# Altium schematic sheet [2] MCU.SchDoc
size A4; DocumentNumber: 3; SheetNumber: 3; SheetTotal: 4
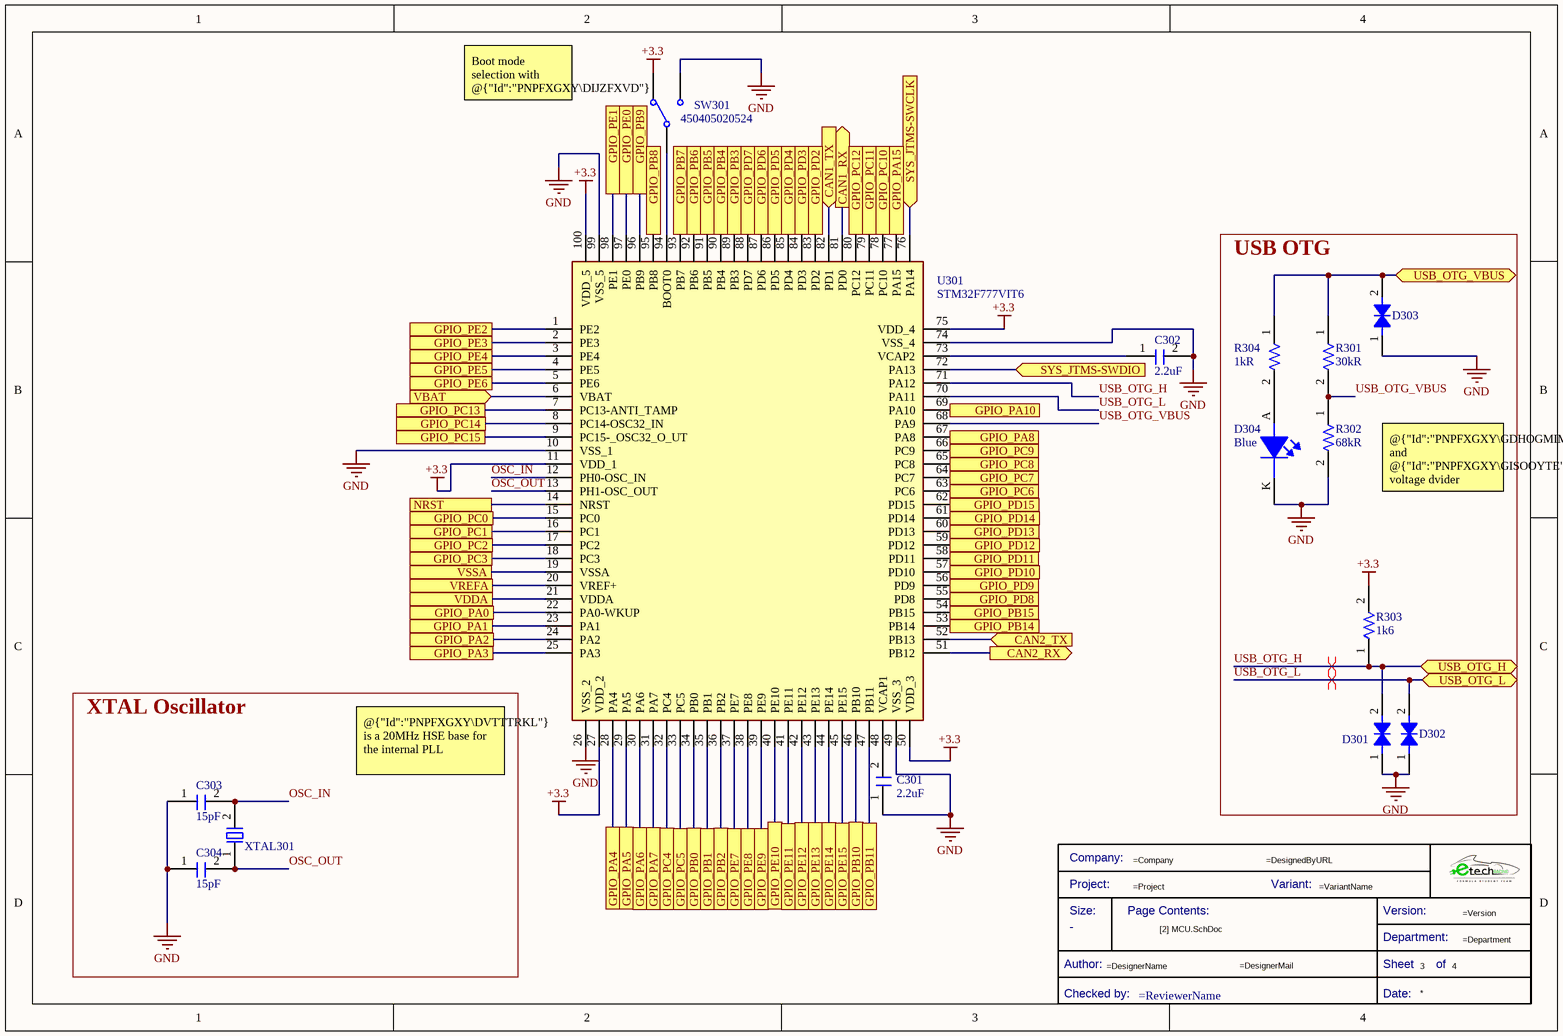
[diagram p0: [2] MCU.SchDoc]

## Parts
*?  Title Block_template  (value not drawn)  (graphical)
C301  Capacitance: 2.2uF  [C2.2u-100V-1812MLCC-X7R]  (hidden comment: HMK432B7225KM-T)
C302  Capacitance: 2.2uF  [C2.2u-100V-1812MLCC-X7R]  (hidden comment: HMK432B7225KM-T)
C303  Capacitance: 15pF  [C0805FNPC-R]  (hidden comment: 885012007052)
C304  Capacitance: 15pF  [C0805FNPC-R]  (hidden comment: 885012007052)
D301  824551301  [DTVS-DO-214AB]  (value not drawn)
D302  824551301  [DTVS-DO-214AB]  (value not drawn)
D303  824551301  [DTVS-DO-214AB]  (value not drawn)
D304  Color: Blue  [LED_0805_WE]  (hidden comment: 150080BS75000)
R301  Resistance: 30kR  [R1206FTK-W]  (hidden comment: CRCW120630K0FKEA)
R302  Resistance: 68kR  [R1206FTK-W]  (hidden comment: CR1206AFX-6802EAS)
R303  Resistance: 1k6  [R1206FTK-W]  (hidden comment: CRCW12061K60FKEA)
R304  Resistance: 1kR  [R0805FTK]  (hidden comment: CR0805-JW-102ELF)
SW301  450405020524  [450405020524]
U301  STM32F777VIT6  [QFP50P1600X1600X160-100N]
XTAL301  830028710  [XTAL20M_SMD]  (value not drawn)

## Blocks framed on the sheet
USB OTG: D301-D304 R301-R304
XTAL Oscillator: C303 C304 XTAL301

## Ports
CAN1_RX (out), CAN1_TX (in), CAN2_RX (out), CAN2_TX (in), GPIO_PA0, GPIO_PA1, GPIO_PA2, GPIO_PA3, GPIO_PA4, GPIO_PA5, GPIO_PA6, GPIO_PA7, GPIO_PA8, GPIO_PA10, GPIO_PA15, GPIO_PB0, GPIO_PB1, GPIO_PB2, GPIO_PB3, GPIO_PB4, GPIO_PB5, GPIO_PB6, GPIO_PB7, GPIO_PB8, GPIO_PB9, GPIO_PB10, GPIO_PB11, GPIO_PB14, GPIO_PB15, GPIO_PC0, GPIO_PC1, GPIO_PC2, GPIO_PC3, GPIO_PC4, GPIO_PC5, GPIO_PC6, GPIO_PC7, GPIO_PC8, GPIO_PC9, GPIO_PC10, GPIO_PC11, GPIO_PC12, GPIO_PC13, GPIO_PC14, GPIO_PC15, GPIO_PD2, GPIO_PD3, GPIO_PD4, GPIO_PD5, GPIO_PD6, GPIO_PD7, GPIO_PD8, GPIO_PD9, GPIO_PD10, GPIO_PD11, GPIO_PD12, GPIO_PD13, GPIO_PD14, GPIO_PD15, GPIO_PE0, GPIO_PE1, GPIO_PE2, GPIO_PE3, GPIO_PE4, GPIO_PE5, GPIO_PE6, GPIO_PE7, GPIO_PE8, GPIO_PE9, GPIO_PE10, GPIO_PE11, GPIO_PE12, GPIO_PE13, GPIO_PE14, GPIO_PE15, NRST, SYS_JTMS-SWCLK (in), SYS_JTMS-SWDIO (in), USB_OTG_H (bidir), USB_OTG_L (bidir), USB_OTG_VBUS (bidir), VBAT (in), VDDA, VREFA, VSSA

## Nets
+3.3: R303.2 SW301.L1 U301.11(VDD_1) U301.27(VDD_2) U301.50(VDD_3) U301.75(VDD_4) U301.100(VDD_5)
GND: C301.1 C302.2 C303.1 C304.1 D301.1 D302.1 D303.1 D304.K R302.2 SW301.L2 U301.10(VSS_1) U301.26(VSS_2) U301.49(VSS_3) U301.74(VSS_4) U301.99(VSS_5)
CAN1_RX: U301.81(PD0) ; port CAN1_RX
CAN1_TX: U301.82(PD1) ; port CAN1_TX
CAN2_RX: U301.51(PB12) ; port CAN2_RX
CAN2_TX: U301.52(PB13) ; port CAN2_TX
GPIO_PA0: U301.22(PA0-WKUP) ; port GPIO_PA0
GPIO_PA1: U301.23(PA1) ; port GPIO_PA1
GPIO_PA2: U301.24(PA2) ; port GPIO_PA2
GPIO_PA3: U301.25(PA3) ; port GPIO_PA3
GPIO_PA4: U301.28(PA4) ; port GPIO_PA4
GPIO_PA5: U301.29(PA5) ; port GPIO_PA5
GPIO_PA6: U301.30(PA6) ; port GPIO_PA6
GPIO_PA7: U301.31(PA7) ; port GPIO_PA7
GPIO_PA8: U301.67(PA8) ; port GPIO_PA8
GPIO_PA10: U301.69(PA10) ; port GPIO_PA10
GPIO_PA15: U301.77(PA15) ; port GPIO_PA15
GPIO_PB0: U301.34(PB0) ; port GPIO_PB0
GPIO_PB1: U301.35(PB1) ; port GPIO_PB1
GPIO_PB2: U301.36(PB2) ; port GPIO_PB2
GPIO_PB3: U301.89(PB3) ; port GPIO_PB3
GPIO_PB4: U301.90(PB4) ; port GPIO_PB4
GPIO_PB5: U301.91(PB5) ; port GPIO_PB5
GPIO_PB6: U301.92(PB6) ; port GPIO_PB6
GPIO_PB7: U301.93(PB7) ; port GPIO_PB7
GPIO_PB8: U301.95(PB8) ; port GPIO_PB8
GPIO_PB9: U301.96(PB9) ; port GPIO_PB9
GPIO_PB10: U301.46(PB10) ; port GPIO_PB10
GPIO_PB11: U301.47(PB11) ; port GPIO_PB11
GPIO_PB14: U301.53(PB14) ; port GPIO_PB14
GPIO_PB15: U301.54(PB15) ; port GPIO_PB15
GPIO_PC0: U301.15(PC0) ; port GPIO_PC0
GPIO_PC1: U301.16(PC1) ; port GPIO_PC1
GPIO_PC2: U301.17(PC2) ; port GPIO_PC2
GPIO_PC3: U301.18(PC3) ; port GPIO_PC3
GPIO_PC4: U301.32(PC4) ; port GPIO_PC4
GPIO_PC5: U301.33(PC5) ; port GPIO_PC5
GPIO_PC6: U301.63(PC6) ; port GPIO_PC6
GPIO_PC7: U301.64(PC7) ; port GPIO_PC7
GPIO_PC8: U301.65(PC8) ; port GPIO_PC8
GPIO_PC9: U301.66(PC9) ; port GPIO_PC9
GPIO_PC10: U301.78(PC10) ; port GPIO_PC10
GPIO_PC11: U301.79(PC11) ; port GPIO_PC11
GPIO_PC12: U301.80(PC12) ; port GPIO_PC12
GPIO_PC13: U301.7(PC13-ANTI_TAMP) ; port GPIO_PC13
GPIO_PC14: U301.8(PC14-OSC32_IN) ; port GPIO_PC14
GPIO_PC15: U301.9(PC15-_OSC32_O_UT) ; port GPIO_PC15
GPIO_PD2: U301.83(PD2) ; port GPIO_PD2
GPIO_PD3: U301.84(PD3) ; port GPIO_PD3
GPIO_PD4: U301.85(PD4) ; port GPIO_PD4
GPIO_PD5: U301.86(PD5) ; port GPIO_PD5
GPIO_PD6: U301.87(PD6) ; port GPIO_PD6
GPIO_PD7: U301.88(PD7) ; port GPIO_PD7
GPIO_PD8: U301.55(PD8) ; port GPIO_PD8
GPIO_PD9: U301.56(PD9) ; port GPIO_PD9
GPIO_PD10: U301.57(PD10) ; port GPIO_PD10
GPIO_PD11: U301.58(PD11) ; port GPIO_PD11
GPIO_PD12: U301.59(PD12) ; port GPIO_PD12
GPIO_PD13: U301.60(PD13) ; port GPIO_PD13
GPIO_PD14: U301.61(PD14) ; port GPIO_PD14
GPIO_PD15: U301.62(PD15) ; port GPIO_PD15
GPIO_PE0: U301.97(PE0) ; port GPIO_PE0
GPIO_PE1: U301.98(PE1) ; port GPIO_PE1
GPIO_PE2: U301.1(PE2) ; port GPIO_PE2
GPIO_PE3: U301.2(PE3) ; port GPIO_PE3
GPIO_PE4: U301.3(PE4) ; port GPIO_PE4
GPIO_PE5: U301.4(PE5) ; port GPIO_PE5
GPIO_PE6: U301.5(PE6) ; port GPIO_PE6
GPIO_PE7: U301.37(PE7) ; port GPIO_PE7
GPIO_PE8: U301.38(PE8) ; port GPIO_PE8
GPIO_PE9: U301.39(PE9) ; port GPIO_PE9
GPIO_PE10: U301.40(PE10) ; port GPIO_PE10
GPIO_PE11: U301.41(PE11) ; port GPIO_PE11
GPIO_PE12: U301.42(PE12) ; port GPIO_PE12
GPIO_PE13: U301.43(PE13) ; port GPIO_PE13
GPIO_PE14: U301.44(PE14) ; port GPIO_PE14
GPIO_PE15: U301.45(PE15) ; port GPIO_PE15
NRST: U301.14(NRST) ; port NRST
OSC_IN: C303.2 U301.12(PH0-OSC_IN) XTAL301.2
OSC_OUT: C304.2 U301.13(PH1-OSC_OUT) XTAL301.1
SYS_JTMS-SWCLK: U301.76(PA14) ; port SYS_JTMS-SWCLK
SYS_JTMS-SWDIO: U301.72(PA13) ; port SYS_JTMS-SWDIO
USB_OTG_H: D301.2 R303.1 U301.71(PA12) ; port USB_OTG_H
USB_OTG_L: D302.2 U301.70(PA11) ; port USB_OTG_L
USB_OTG_VBUS: R301.2 R302.1 U301.68(PA9)
USB_OTG_VBUS: D303.2 R301.1 R304.1 ; port USB_OTG_VBUS  [a separate net that carries the same name]
VBAT: U301.6(VBAT) ; port VBAT
VDDA: U301.21(VDDA) ; port VDDA
VREFA: U301.20(VREF+) ; port VREFA
VSSA: U301.19(VSSA) ; port VSSA
NetC301_2: C301.2 U301.48(VCAP1)
NetC302_1: C302.1 U301.73(VCAP2)
NetD304_A: D304.A R304.2
NetSW301_COM: SW301.COM U301.94(BOOT0)

## Layout directives
differential pair: USB_OTG_H, USB_OTG_L

## Notes on the sheet
- Boot mode selection with @{"Id":"PNPFXGXY\DIJZFXVD"}
- @{"Id":"PNPFXGXY\GDHOGMIM"} and @{"Id":"PNPFXGXY\GISOOYTE"} voltage dvider required to match AMR
- @{"Id":"PNPFXGXY\DVTTTRKL"} is a 20MHz HSE base for the internal PLL
- (in symbol Title Block_template) Company:; Project:; Variant:; Size:; Page Contents:; Version:; Department:; Author:; Sheet; of; Checked by:; Date:

## Library data of the parts
*? = Title Block_template: Standard Title Block; .Creator: GP; Category: Title Block; .PCBcheck: GP; .SCHcheck: GP; Checked by:: =ReviewerName; Size: -
C301 C302 = C2.2u-100V-1812MLCC-X7R: 贴片陶瓷电容 2.2uF ±10% 100V X7R 1812; Manufacturer: Taiyo Yuden; .Creator: DO; Manufacturer Part Number: HMK432B7225KM-T; RoHS: Yes; Category: Ceramic Capacitors; Stock 1: 13000; Pricing 1: 500=0,58000, 1000=0,47500, 1500=0,47000, 2000=0,46500 (USD); Mount: Surface Mount; Case/Package: 1812; Number of Pins: 2; Case Code (Metric): 4532; Case Code (Imperial): 1812; Min Operating Temperature: -55°C; Max Operating Temperature: 125°C; Package Quantity: 1; Voltage Rating: 100V; Tolerance: 10%; Packaging: Tape and Reel; Voltage Rating (DC): 100V; Dielectric: X7R; Termination: SMD/SMT; Series: M; Construction: Flat; Resistor Type: Ceramic; Length: 4.5mm; Width: 0.126inch; Height: 2.5mm; Thickness: 0.106inch; Depth: 3.2mm; Radiation Hardening: No; RoHS Compliant: Yes; REACH SVHC: Unknown; Halogen Free: Halogen Free; ComponentLink1URL: https://datasheet.ciiva.com/142/hmk432b7225km-t-ss-142288.pdf?src-supplier=Digi-Key; ComponentLink1Description: https://datasheet.ciiva.com/142/hmk432b7225km-t-ss-142288.pdf?src-supplier=Digi-Key; ComponentLink2URL: https://datasheet.ciiva.com/26871/getdatasheetpartid-638888-26871989.pdf?src-supplier=Verical; ComponentLink2Description: https://datasheet.ciiva.com/26871/getdatasheetpartid-638888-26871989.pdf?src-supplier=Verical; ComponentLink3URL: https://datasheet.ciiva.com/30247/946hmk432b7225km-t-30247370.pdf?src-supplier=Onlinecomponents.com; ComponentLink3Description: https://datasheet.ciiva.com/30247/946hmk432b7225km-t-30247370.pdf?src-supplier=Onlinecomponents.com; ComponentLink4URL: https://datasheet.ciiva.com/28645/746258-28645086.pdf?src-supplier=Element14; ComponentLink4Description: https://datasheet.ciiva.com/28645/746258-28645086.pdf?src-supplier=Element14; ComponentLink5URL: https://datasheet.ciiva.com/15921/mlcc06-e-15921031.pdf?src-supplier=Onlinecomponents.com; ComponentLink5Description: https://datasheet.ciiva.com/15921/mlcc06-e-15921031.pdf?src-supplier=Onlinecomponents.com; Supplier Part Number 1: 9062137; Supplier 1: Future Electronics
C303 C304 = C15p-50V-0805FNPC-NP0: Cap, 15PF, 50V, 5%, C0G/NP0, 0805; Manufacturer 1: Wurth Electronics; .Creator: DR; Supplier 1: Newark; Manufacturer Part Number 1: 885012007052; RoHS: Yes; Category: Ceramic Capacitors; Stock 1: 815; Pricing 1: 1=0,10800, 10=0,05200, 25=0,05100, 50=0,04900, 100=0,04800, 250=0,04600, 500=0,04300 (USD); Mount: Surface Mount; Case/Package: 0805; Case Code (Metric): 2012; Case Code (Imperial): 0805; Min Operating Temperature: -55°C; Max Operating Temperature: 125°C; Packaging: Cut Tape; Voltage Rating: 50V; Tolerance: 5%; Length: 0.079inch; Width: 0.049inch; Thickness: 0.028inch; RoHS Compliant: Yes; ComponentLink1URL: http://www.farnell.com/datasheets/2031702.pdf?src-supplier=Farnell; ComponentLink1Description: http://www.farnell.com/datasheets/2031702.pdf?src-supplier=Farnell; ComponentLink2URL: http://katalog.we-online.de/pbs/datasheet/885012007052.pdf?src-supplier=Digi-Key; ComponentLink2Description: http://katalog.we-online.de/pbs/datasheet/885012007052.pdf?src-supplier=Digi-Key; ComponentLink3URL: https://katalog.we-online.de/pbs/datasheet/885012007052.pdf?src-supplier=Digi-Key; ComponentLink3Description: https://katalog.we-online.de/pbs/datasheet/885012007052.pdf?src-supplier=Digi-Key; Supplier Part Number 1: 15AC9316
D301-D303 = DTVS-40V-DO-214AB: TVS diode [Würth Elektronik] 824551301 TVS diode; Manufacturer: Wurth Electronics; Number of Bidirectional Channels: 1; Reverse Standoff Voltage: 30V; Min Breakdown Voltage: 35.05V; Clamping Voltage: 48.4V; Peak Pulse Power: 3kW; Power Line Protection: No; Polarity: Bidirectional; Peak Pulse Current: 62A; .Creator: DO; ComponentLink2Description: Where buy it; ComponentLink2URL: https://www.we-online.com/catalog/en/WE-TVSP?sq=824551301#824551301; Supplier 1: RSComponents; Manufacturer Part Number: 824551301; RoHS: Yes; Category: TVS Diodes; Stock 1: 1; Pricing 1: 10=1,72500, 50=1,54700, 100=1,45300, 250=1,35100, 500=1,15000 (USD); Mount: Surface Mount; Number of Pins: 2; Min Operating Temperature: -65°C; Max Operating Temperature: 150°C; Packaging: Cut Tape; Max Breakdown Voltage: 35.05V; Resistor Type: Zener; REACH SVHC: Unknown; RoHS Compliant: Yes; ComponentLink1URL: http://www.farnell.com/datasheets/2036459.pdf?src-supplier=Element14; ComponentLink1Description: http://www.farnell.com/datasheets/2036459.pdf?src-supplier=Element14; Supplier Part Number 1: 9217092P
D304 = LEDBS-0805-145: LED BLUE CLEAR 0805 SMD; Manufacturer 1: Wurth Electronics; Luminous Intensity: 145mcd; Viewing Angle: 140°; Forward Voltage: 3.2V; Wavelength: 470nm; Lens Style: Clear,Rectangular; Forward Current: 30mA; Test Current: 20mA; .Creator: GP; ComponentLink1Description: Datasheet; ComponentLink1URL: https://www.we-online.com/catalog/datasheet/150080BS75000.pdf; ComponentLink2Description: Where buy it; ComponentLink2URL: https://katalog.we-online.de/en/led/WL-SMCW/150080BS75000; Supplier 1: RSComponents; Manufacturer Part Number 1: 150080BS75000; RoHS: Yes; Category: LEDs; Stock 1: 7400; Pricing 1: 50=0,19300, 500=0,12900, 1000=0,12200, 2000=0,11700, 4000=0,11100 (USD); Mount: Surface Mount; Case/Package: 0805; Case Code (Metric): 2012; Case Code (Imperial): 0805; Min Operating Temperature: -40°C; Max Operating Temperature: 85°C; Package Quantity: 4000; Packaging: Tape and Reel; Dominant Wavelength: 470nm; Length: 2mm; Width: 1.25mm; Height: 0.7mm; REACH SVHC: Unknown; RoHS Compliant: Yes; Lead Free: Lead Free; ComponentLink3URL: https://datasheet.ciiva.com/23843/150080bs75000-23843251.pdf?src-supplier=Newark; ComponentLink3Description: https://datasheet.ciiva.com/23843/150080bs75000-23843251.pdf?src-supplier=Newark; ComponentLink4URL: https://datasheet.ciiva.com/22656/1740214-22656954.pdf?src-supplier=Element14; ComponentLink4Description: https://datasheet.ciiva.com/22656/1740214-22656954.pdf?src-supplier=Element14; ComponentLink5URL: https://datasheet.ciiva.com/29279/759433-da-01-en-chipled-0805-w-kl-blau-150080bs75000-29279203.pdf?src-supplier=Conrad; ComponentLink5Description: https://datasheet.ciiva.com/29279/759433-da-01-en-chipled-0805-w-kl-blau-150080bs75000-29279203.pdf?src-supplier=Conrad; ComponentLink6URL: https://datasheet.ciiva.com/29562/150080bs75000-29562922.pdf?src-supplier=Digi-Key; ComponentLink6Description: https://datasheet.ciiva.com/29562/150080bs75000-29562922.pdf?src-supplier=Digi-Key; ComponentLink7URL: https://datasheet.ciiva.com/29562/150080bs75000-29562923.pdf?src-supplier=Digi-Key; ComponentLink7Description: https://datasheet.ciiva.com/29562/150080bs75000-29562923.pdf?src-supplier=Digi-Key; Supplier Part Number 1: 8154228
R301 = R30k-1206FTK: Res Thick Film 1206 30K Ohm 1% 1/4W ±100ppm/°C Molded SMD SMD Paper T/R; Manufacturer: Vishay; Power Rating: 250mW; Voltage Rating: 200V; .Creator: GP; Category: Resistor; ComponentLink1Description: Datasheet; ComponentLink1URL: https://docs.rs-online.com/bca8/A700000006404581.pdf; ComponentLink2Description: Where buy it; ComponentLink2URL: https://es.rs-online.com/web/p/resistencias-de-montaje-en-superficie/6792039; Supplier 1: RSComponents; Manufacturer Part Number: CRCW120630K0FKEA; RoHS: Yes; Stock 1: 3550; Pricing 1: 50=0,12000, 500=0,11200, 1000=0,10400, 2000=0,09700, 4000=0,08900 (USD); Case/Package: 1206; Number of Pins: 2; Contact Plating: Tin; Case Code (Imperial): 1206; Case Code (Metric): 3216; Weight: 0.000353oz; Size Code: 1206; Min Operating Temperature: -55°C; Max Operating Temperature: 155°C; Tolerance: 1%; Resistor Type: Thick Film; Packaging: Tape and Reel; Temperature Coefficient: 100ppm/°C; Package Quantity: 10; Termination: SMD/SMT; Number of Terminations: 2; Max Power Dissipation: 250mW; Features: Automotive AEC-Q200; Series: CRCW; Construction: Rectangular; Resistance Tolerance: 1%; Technology: THICK FILM; Length: 3.2mm; Width: 1.6mm; Height: 0.55mm; Depth: 1.6mm; Radiation Hardening: No; RoHS Compliant: Yes; REACH SVHC: Unknown; Military Standard: Not; Supplier Part Number 1: 6792039
R302 = R68k-1206FTK: Resistor, AS 1206 68k1% 250mW TC100; Manufacturer: Bourns; .Creator: DO; Supplier 1: Newark; Manufacturer Part Number: CR1206AFX-6802EAS; RoHS: Yes; Category: Chip SMD Resistors; Stock 1: 4700; Pricing 1: 1=0,01100, 25=0,01100, 50=0,01100, 100=0,01100, 250=0,01100, 500=0,01100 (USD); Supplier Part Number 1: 16AH0632; ComponentLink1Description: Where buy it; ComponentLink1URL: https://www.mouser.es/ProductDetail/Bourns/CR1206AFX-6802EAS?qs=PzGy0jfpSMtMA5jyzS7M7w%3D%3D; ComponentLink2Description: Datasheet; ComponentLink2URL: https://www.mouser.es/datasheet/2/54/cr_a_as-1858644.pdf
R303 = R1.6K-1206FTK: Res Thick Film 1206 1.6K Ohm 1% 1/4W ±100ppm/°C Molded SMD SMD Paper T/R; Manufacturer 1: Vishay; Max Power Dissipation: 250mW; Voltage Rating: 200V; .Creator: DO; Supplier 1: Digi-Key; Manufacturer Part Number 1: CRCW12061K60FKEA; RoHS: Yes; Category: Chip SMD Resistors; Pricing 1: 1=0,10000, 10=0,08200, 100=0,03160, 1000=0,01392, 2500=0,01202 (USD); Case/Package: 1206; Number of Pins: 2; Contact Plating: Tin; Case Code (Metric): 3216; Case Code (Imperial): 1206; Weight: 0.000353oz; Size Code: 1206; Min Operating Temperature: -55°C; Max Operating Temperature: 155°C; Tolerance: 1%; Resistor Type: Thick Film; Temperature Coefficient: 100ppm/°C; Package Quantity: 5000; Packaging: Tape and Reel; Number of Terminations: 2; Features: Automotive AEC-Q200; Series: CRCW; Power Rating: 250mW; Termination: SMD/SMT; Voltage Rating (DC): 200V; Resistance Tolerance: 1%; Technology: THICK FILM; Construction: Rectangular; Length: 3.2mm; Width: 0.063inch; Height: 0.55mm; Depth: 1.6mm; Radiation Hardening: No; Lead Free: Lead Free; RoHS Compliant: Yes; REACH SVHC: Unknown; Military Standard: Not; ComponentLink1URL: https://datasheet.ciiva.com/11811/0900766b80d98b5e-11811377.pdf?src-supplier=RSComponents; ComponentLink1Description: https://datasheet.ciiva.com/11811/0900766b80d98b5e-11811377.pdf?src-supplier=RSComponents; ComponentLink2URL: https://datasheet.ciiva.com/2515/dcrcwe3-2515616.pdf?src-supplier=Digi-Key; ComponentLink2Description: https://datasheet.ciiva.com/2515/dcrcwe3-2515616.pdf?src-supplier=Digi-Key; ComponentLink3URL: https://datasheet.ciiva.com/2515/dcrcwe3-2515617.pdf?src-supplier=Digi-Key; ComponentLink3Description: https://datasheet.ciiva.com/2515/dcrcwe3-2515617.pdf?src-supplier=Digi-Key; ComponentLink4URL: https://datasheet.ciiva.com/2515/dcrcwe3-2515618.pdf?src-supplier=Digi-Key; ComponentLink4Description: https://datasheet.ciiva.com/2515/dcrcwe3-2515618.pdf?src-supplier=Digi-Key; ComponentLink5URL: https://datasheet.ciiva.com/9098/dcrcwe3-9098889.pdf?src-supplier=Avnet; ComponentLink5Description: https://datasheet.ciiva.com/9098/dcrcwe3-9098889.pdf?src-supplier=Avnet; ComponentLink6URL: https://datasheet.ciiva.com/16213/dcrcwe3-16213498.pdf?src-supplier=Future+Electronics; ComponentLink6Description: https://datasheet.ciiva.com/16213/dcrcwe3-16213498.pdf?src-supplier=Future+Electronics; ComponentLink7URL: https://datasheet.ciiva.com/17203/dcrcwe3-17203786.pdf?src-supplier=Avnet+Europe; ComponentLink7Description: https://datasheet.ciiva.com/17203/dcrcwe3-17203786.pdf?src-supplier=Avnet+Europe; ComponentLink8URL: https://datasheet.ciiva.com/7670/1697337-7670316.pdf?src-supplier=Element14; ComponentLink8Description: https://datasheet.ciiva.com/7670/1697337-7670316.pdf?src-supplier=Element14; ComponentLink9URL: https://datasheet.ciiva.com/7670/1697337-7670317.pdf?src-supplier=Element14; ComponentLink9Description: https://datasheet.ciiva.com/7670/1697337-7670317.pdf?src-supplier=Element14; ComponentLink10URL: https://datasheet.ciiva.com/5550/dcrcwe3-109170-5550718.pdf?src-supplier=Mouser; ComponentLink10Description: https://datasheet.ciiva.com/5550/dcrcwe3-109170-5550718.pdf?src-supplier=Mouser; Supplier Part Number 1: 541-1.60KFCT-ND; ComponentLink11Description: RS; ComponentLink11URL: https://es.rs-online.com/web/p/resistencias-fijas-para-montaje-en-superficie/6791866/
R304 = R1k-0805FTK: Res Thick Film 0805 1K Ohm 5% 1/8W ±200ppm/°C Molded SMD SMD Paper Tape on Plastic Reel; Manufacturer 1: Bourns; Voltage Rating (DC): 150V; Power Rating: 125mW; .Creator: GP; Supplier 1: Arrow Electronics; Manufacturer Part Number 1: CR0805-JW-102ELF; RoHS: Yes; Category: Chip SMD Resistors; Stock 1: 27510; Pricing 1: 1=0,05930, 10=0,03510, 25=0,01790, 100=0,00800, 250=0,00790, 500=0,00590, 1000=0,00360, 3000=0,00350, 6000=0,00250 (USD); Mount: Surface Mount; Case/Package: 0805; Number of Pins: 2; Contact Plating: Tin; Case Code (Metric): 2012; Case Code (Imperial): 0805; Min Operating Temperature: -55°C; Max Operating Temperature: 155°C; Resistor Type: Thick Film; Tolerance: 5%; Temperature Coefficient: 200ppm/°C; Features: Moisture Resistant; Package Quantity: 1; Packaging: Tape and Reel; Voltage Rating: 150V; Number of Terminations: 2; Termination: SMD/SMT; Max Power Dissipation: 125mW; Length: 2mm; Width: 1.25mm; Height: 0.5mm; Thickness: 508um; Depth: 1.25mm; Radiation Hardening: No; Lead Free: Lead Free; REACH SVHC: No SVHC; Military Standard: Not; ComponentLink1URL: https://datasheet.ciiva.com/11821/0900766b80fcdb72-11821134.pdf?src-supplier=RSComponents; ComponentLink1Description: https://datasheet.ciiva.com/11821/0900766b80fcdb72-11821134.pdf?src-supplier=RSComponents; ComponentLink2URL: https://datasheet.ciiva.com/15225/getdatasheetpartid-78155-15225381.pdf?src-supplier=Verical; ComponentLink2Description: https://datasheet.ciiva.com/15225/getdatasheetpartid-78155-15225381.pdf?src-supplier=Verical; ComponentLink3URL: https://datasheet.ciiva.com/22693/1902866-22693253.pdf?src-supplier=Element14; ComponentLink3Description: https://datasheet.ciiva.com/22693/1902866-22693253.pdf?src-supplier=Element14; ComponentLink4URL: https://datasheet.ciiva.com/7986/1856384-7986184.pdf?src-supplier=Element14; ComponentLink4Description: https://datasheet.ciiva.com/7986/1856384-7986184.pdf?src-supplier=Element14; ComponentLink5URL: https://datasheet.ciiva.com/7985/1856384-7985867.pdf?src-supplier=Element14; ComponentLink5Description: https://datasheet.ciiva.com/7985/1856384-7985867.pdf?src-supplier=Element14; ComponentLink6URL: https://datasheet.ciiva.com/30242/159chpreztr-30242765.pdf?src-supplier=Onlinecomponents.com; ComponentLink6Description: https://datasheet.ciiva.com/30242/159chpreztr-30242765.pdf?src-supplier=Onlinecomponents.com; ComponentLink7URL: https://datasheet.ciiva.com/6547/chpreztr-6547359.pdf?src-supplier=Digi-Key; ComponentLink7Description: https://datasheet.ciiva.com/6547/chpreztr-6547359.pdf?src-supplier=Digi-Key; Supplier Part Number 1: CR0805-JW-102ELF
SW301 = 450405020524: WS-SLSU SMT Mini Slide Switch Same Side Connection, SPDT, 5VDC, 300mA, 225g; Manufacturer: Wurth Elektronik; ComponentLink1Description: Website Link; ComponentLink1URL: https://www.we-online.com/redexpert/article/450405020524?ad; ComponentLink2Description: Datasheet Link; ComponentLink2URL: https://www.we-online.com/redexpert/spec/450405020524?ad; Manufacturer Part Number: 450405020524; Category: Slide Switches; Match Code: WS-SLSU; Mount: Surface Mount; Operating Temperature Max: 85°C; Operating Temperature Min: -40°C; Packaging: Tape and Reel; Length: 8.7mm; Width: 3mm; Height: 2mm; Circuit: SPDT; Contact Material: Copper Alloy; Contact Plating: Silver; Operation Force: 225g; Rated Current: 300mA; Rated Voltage: 5VDC; Terminal Material: Copper Alloy; Terminal Plating: Silver
U301 = STM32F777VIT6: ARM Microcontrollers - MCU 16/32-BITS MICROS; Manufacturer_Name: STMicroelectronics; Geometry.Height: 1.6mm; Mouser Part Number: 511-STM32F777VIT6; Mouser Price/Stock: https://www.mouser.co.uk/ProductDetail/STMicroelectronics/STM32F777VIT6?qs=qzCNEk%252BRr%252BbclRoyC9pexg%3D%3D; Manufacturer_Part_Number: STM32F777VIT6; Datasheet Link: https://www.st.com/resource/en/datasheet/stm32f777vi.pdf
XTAL301 = XTAL20M_SMD: 830028710, 20 MHz; Manufacturer: Würth Elektronik; Frequency: 20 MHz; Frequency Stability: +-50 ppm; Drive level: 500µW max; .Creator: GP; Category: XTAL; ComponentLink1Description: Datasheet; ComponentLink1URL: https://www.we-online.com/catalog/datasheet/830028710.pdf; ComponentLink2Description: Where buy it; Package: *; Manufacturer part number: 830028710; Supplier: Würth Elektronik; Packaging: Reel; Max operating temperature.: 85ºC; Min operating temperature: -40ºC; Max power dissipation: *; Power rating: *; RoHS: Yes; Number of pins: 2; Type: SMD; Supplier 1: Digi-Key; Stock 1: 975; Pricing 1: 1=0,37000, 10=0,28100, 50=0,26800, 100=0,24400, 500=0,22000 (USD); Supplier Part Number 1: 1923-830028710CT-ND